# Altium project TLM_002_001.PrjPcb (part 2 of 2)

## Sheet TLM_002_CONNECT.SchDoc: =DocumentName
size A4; Author: Nazar Lysenko/Andrii Antonenko; CompanyName: Scopa Industries LLC; Engineer: Nazar Lysenko / Andrii Antonenko; Organization: Scopa Industries LLC; Address1: Kyiv; Address2: Ukraine; Address3: https://www.scopa.industries/; Address4: oleksyi.y@scopa.industries; Revision: 1; SheetNumber: 11; SheetTotal: 11
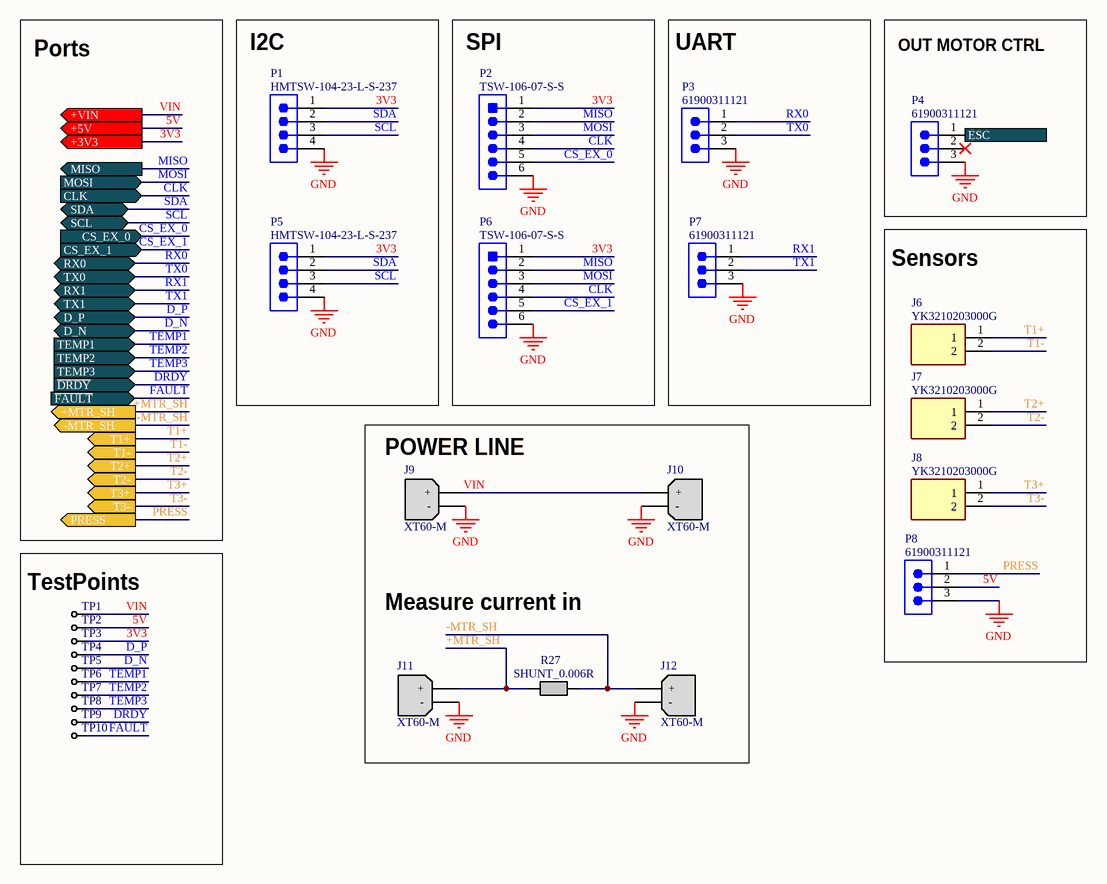
[diagram p10: TLM_002_CONNECT.SchDoc]

### Parts
J6  YK3210203000G  [YK3210203000G]
J7  YK3210203000G  [YK3210203000G]
J8  YK3210203000G  [YK3210203000G]
J9  XT60-M  [AMASS_XT60-M]
J10  XT60-M  [AMASS_XT60-M]
J11  XT60-M  [AMASS_XT60-M]
J12  XT60-M  [AMASS_XT60-M]
P1  HMTSW-104-23-L-S-237  [SMTC-HMTSW-104-23-X-S-237]
P2  TSW-106-07-S-S  [SMTC-TSW-106-07-S-S_V]
P3  61900311121  [61900311121]
P4  61900311121  [61900311121]
P5  HMTSW-104-23-L-S-237  [SMTC-HMTSW-104-23-X-S-237]
P6  TSW-106-07-S-S  [SMTC-TSW-106-07-S-S_V]
P7  61900311121  [61900311121]
P8  61900311121  [61900311121]
R27  SHUNT_0.006R  [SHUNT]
TP1  TestPoint  [TestPoint]  (value not drawn)
TP2  TestPoint  [TestPoint]  (value not drawn)
TP3  TestPoint  [TestPoint]  (value not drawn)
TP4  TestPoint  [TestPoint]  (value not drawn)
TP5  TestPoint  [TestPoint]  (value not drawn)
TP6  TestPoint  [TestPoint]  (value not drawn)
TP7  TestPoint  [TestPoint]  (value not drawn)
TP8  TestPoint  [TestPoint]  (value not drawn)
TP9  TestPoint  [TestPoint]  (value not drawn)
TP10  TestPoint  [TestPoint]  (value not drawn)

### Ports
+3V3 (out, see TLM_002_MBR[4A], TLM_002_SRC[4C]), +5V (out, see TLM_002_MBR[4A], TLM_002_SRC[4A]), +MTR_SH (out, see TLM_002_MBR[4C]), +VIN (out, see TLM_002_MBR[4A]), -MTR_SH (out, see TLM_002_MBR[4C]), CLK (in, see TLM_002_MBR[4B], TLM_002_ESP32S3[2B], TLM_002_MAX6675[2B], TLM_002_MAX31856[2B], TLM_002_SD[3B]), CS_EX_0 (in, see TLM_002_MBR[4B], TLM_002_ESP32S3[3B]), CS_EX_1 (in, see TLM_002_MBR[4B], TLM_002_ESP32S3[3B]), D_N (bidir, see TLM_002_MBR[4C], TLM_002_ESP32S3[3A], TLM_002_SRC[2C]), D_P (bidir, see TLM_002_MBR[4C], TLM_002_ESP32S3[3A], TLM_002_SRC[2C]), ESC (in, see TLM_002_MBR[4C], TLM_002_ESP32S3[3B]), MISO (out, see TLM_002_MBR[4B], TLM_002_ESP32S3[3B], TLM_002_MAX6675[2B], TLM_002_MAX31856[2B], TLM_002_SD[3B]), MOSI (in, see TLM_002_MBR[4B], TLM_002_ESP32S3[2B], TLM_002_MAX31856[2B], TLM_002_SD[3B]), PRESS (out, see TLM_002_MBR[4B], TLM_002_MCP3021[1B]), RX0 (bidir, see TLM_002_MBR[4C], TLM_002_ESP32S3[4A]), RX1 (bidir, see TLM_002_MBR[4C], TLM_002_ESP32S3[2B]), SCL (bidir, see TLM_002_MBR[4C], TLM_002_DS3231SN_RTC[2B], TLM_002_ESP32S3[2B], TLM_002_INA228[2B], TLM_002_MCP3021[4B]), SDA (bidir, see TLM_002_MBR[4B], TLM_002_DS3231SN_RTC[2B], TLM_002_ESP32S3[2B], TLM_002_INA228[2B], TLM_002_MCP3021[3B]), T1+ (out, see TLM_002_MBR[4B]), T1- (out, see TLM_002_MBR[4B]), T2+ (out, see TLM_002_MBR[4B]), T2- (out, see TLM_002_MBR[4B]), T3+ (out, see TLM_002_MBR[4B]), T3- (out, see TLM_002_MBR[4B]), TEMP1 (in, see TLM_002_MBR[4C], TLM_002_ESP32S3[2B]), TEMP2 (in, see TLM_002_MBR[4D], TLM_002_ESP32S3[2B]), TEMP3 (in, see TLM_002_MBR[4D], TLM_002_ESP32S3[2B]), TX0 (bidir, see TLM_002_MBR[4C], TLM_002_ESP32S3[4B]), TX1 (bidir, see TLM_002_MBR[4C], TLM_002_ESP32S3[2B]), ~{DRDY} (in, see TLM_002_MBR[4C], TLM_002_MAX31856[2C]), ~{FAULT} (in, see TLM_002_MBR[4C], TLM_002_MAX31856[2B])

### Nets
3V3: P1.1 P2.1 P5.1 P6.1 TP3.1 ; port +3V3  [project net -3V3_CTRL]
5V: P8.2 TP2.1 ; port +5V  [project net +5V]
GND: J9.2(-) J10.2(-) J11.2(-) J12.2(-) P1.4 P2.6 P3.3 P4.3 P5.4 P6.6 P7.3 P8.3
VIN: J9.1(+) J10.1(+) TP1.1 ; port +VIN
+MTR_SH: J11.1(+) R27.1 ; port +MTR_SH
-MTR_SH: J12.1(+) R27.2 ; port -MTR_SH
CLK: P2.4 P6.4 ; port CLK
CS_EX_0: P2.5 ; port CS_EX_0
CS_EX_1: P6.5 ; port CS_EX_1
~{DRDY}: TP9.1 ; port ~{DRDY}
D_N: TP5.1 ; port D_N
D_P: TP4.1 ; port D_P
ESC: P4.1 ; port ESC
~{FAULT}: TP10.1 ; port ~{FAULT}
MISO: P2.2 P6.2 ; port MISO
MOSI: P2.3 P6.3 ; port MOSI
PRESS: P8.1 ; port PRESS
RX0: P3.1 ; port RX0
RX1: P7.1 ; port RX1
SCL: P1.3 P5.3 ; port SCL
SDA: P1.2 P5.2 ; port SDA
T1+: J6.1 ; port T1+
T1-: J6.2 ; port T1-
T2+: J7.1 ; port T2+
T2-: J7.2 ; port T2-
T3+: J8.1 ; port T3+
T3-: J8.2 ; port T3-
TEMP1: TP6.1 ; port TEMP1
TEMP2: TP7.1 ; port TEMP2
TEMP3: TP8.1 ; port TEMP3
TX0: P3.2 ; port TX0
TX1: P7.2 ; port TX1

Not connected (* = marked no-connect by the designer): P4 2*

### Notes on the sheet
- I2C
- SPI
- UART
- Ports
- OUT MOTOR CTRL (ESC)
- Sensors
- POWER LINE
- TestPoints
- Measure current in motor
- Title
- Size:
- Date:
- A4
- Author:
- Time:
- Sheet
- Revision:
- of
- File:

### Library data of the parts
J6-J8 = YK3210203000G: Connector; Manufacturer_Name: Amphenol; Datasheet Link: https://eu.mouser.com/datasheet/2/18/7Pva_Bm2hlSl-1379478.pdf; Height: 15.9mm; Manufacturer_Part_Number: YK3210203000G; Mouser Part Number: 649-YK32102030J0G; Mouser Price/Stock: https://www.mouser.co.uk/ProductDetail/Amphenol-Anytek/YK3210203000G?qs=Mv7BduZupUi0q03DSkdXZw%3D%3D
J9-J12 = XT60-M: Plug; DC supply; XT60; male; PIN: 2; for cable; soldered; 30A; 500V; MF: AMASS; SnapEDA_Link: https://www.snapeda.com/parts/XT60-M/AMASS/view-part/?ref=snap; Package: Package; MP: XT60-M; Check_prices: https://www.snapeda.com/parts/XT60-M/AMASS/view-part/?ref=eda
P1 P5 = CMP-1024-00020-1: Modified .025" SQ Post Header, Through-hole, Vertical, -55 to 125 degC, 2.54 mm Pitch, 4-Pin, Male, RoHS; Manufacturer: Samtec; Pitch: 2.54 mm; ComponentLink3URL: http://www.samtec.com/documents/webfiles/cpdf/HMTSW-XXX-XX-X-X-XXXX-XX-XX-MKT1.pdf; PartNumber: HMTSW-104-23-L-S-237; Temperature Range: -55 to 125 degC; ComponentLink1Description: Manufacturer URL; Orientation: Vertical; ComponentLink3Description: Package Specification; ComponentLink2URL: http://www.samtec.com/documents/webfiles/pdf/HMTSW.PDF; DatasheetVersion: F-214; PackageDescription: Assembly .025 [.64] SQ. Post Hi-Temp Terminal Strip; ComponentLink1URL: http://www.samtec.com; PackageReference: HMTSW-104-23-X-S-237; RoHS: True; Mounting Technology: Through-hole; ComponentLink2Description: Datasheet; PackageVersion: AL, 3/1987
P2 P6 = CMP-1681-00007-2: Male Header, Pitch 2.54 mm, 1 x 6 Position, Height 8.38 mm, Tail Length 2.54 mm, -55 to 125 degC, RoHS, Bulk; Manufacturer: Samtec; Rows: 1; Contact Finish: Gold; Lead Pitch: 0.1 inch; Package Quantity: 1; Mounting Technology: Through Hole; ComponentLink1Description: Manufacturer URL; Contact Plating: Gold; DatasheetVersion: 12/2015; ComponentLink3Description: Package Specification; PackageDescription: Male Header, Pitch 2.54 mm, 1 x 6 Position, Height 8.38 mm, Tail Length 2.54 mm; Height: 8.38 mm; ComponentLink2Description: Datasheet; RoHSCompliant: true; Colour: Black; Packaging: Bulk; Min Operating Temperature: -55 degC; ComponentLink2URL: http://suddendocs.samtec.com/catalog_english/tsw_th.pdf; Mount: Through Hole; PackageReference: TSW-102-07-S-S; Pins: 6; Max Operating Temperature: 125 degC; ComponentLink3URL: http://suddendocs.samtec.com/prints/tsw-xxx-xx-x-x-xx-xxx-footprint.pdf; Length: 15.24 mm; Contact Material: Bronze; ComponentLink1URL: http://www.samtec.com/
P3 P4 P7 P8 = CMP-1502-00585-2: NexarPartId: 18818222; Current Rating: 3A; Voltage Rating: 250V; Number of Positions: 3; Insulation Resistance: 1GΩ; Gender: Male; Pitch: 2.54mm; Connector Type: Male Pin; Contact Resistance: 20mΩ; Termination: Through Hole; Width: 7.66mm; Contact Plating: Tin; Orientation: Vertical; Mount: Through Hole; Contact Gender: Male; Max Operating Temperature: 105°C; Length: 7.62mm; Number of Rows: 1; Height: 12.5mm; Lead Pitch: 2.54mm; Housing Material: Nylon; Color: Beige; Contact Material: Copper; Fastening Type: Friction; Min Operating Temperature: -40°C; Number of Contacts: 3; Number of Pins: 3; Flammability Rating: UL94 V-0; Contact Mating Length: 7.493mm; RoHS: Compliant; REACH SVHC: Unknown; Packaging: Bulk; Operating Supply Voltage: 250V

## Nets that join several sheets
+5V: TLM_002_MCP3021 (5 pins), INA228_1 (R12_INA228_1.2), TLM_002_SRC (C29.2 IC5.3 R18.1), TLM_002_CONNECT (P8.2 TP2.1)
-3V3_CTRL: MAX6675_1 (C5_MAX6675_1.2 C6_MAX6675_1.2 IC2_MAX6675_1.4), TLM_002_MCP3021 (Q1.2 Q1.5), INA228_3 (C14_INA228_3.2 C15_INA228_3.2 U1_INA228_3.2 U1_INA228_3.6), TLM_002_ESP32S3 (7 pins), TLM_002_MAX31856 (6 pins), TLM_002_SD (7 pins), TLM_002_DS3231SN_RTC (C18.2 C19.2 U2.2), MAX6675_2 (C5_MAX6675_2.2 C6_MAX6675_2.2 IC2_MAX6675_2.4), INA228_2 (5 pins), INA228_1 (C14_INA228_1.2 C15_INA228_1.2 U1_INA228_1.6), TLM_002_SRC (R21.1), TLM_002_LoRa (C30.2 C31.2 IC6.3), TLM_002_CONNECT (5 pins)
GND: MAX6675_1 (C5_MAX6675_1.1 C6_MAX6675_1.1 IC2_MAX6675_1.1), TLM_002_MCP3021 (C20.1 C21.1 C22.1 U3.2), INA228_3 (C14_INA228_3.1 C15_INA228_3.1 U1_INA228_3.1 U1_INA228_3.7), TLM_002_ESP32S3 (19 pins), TLM_002_MAX31856 (8 pins), TLM_002_SD (7 pins), TLM_002_DS3231SN_RTC (BT1.1 C18.1 C19.1 U2.13), MAX6675_2 (C5_MAX6675_2.1 C6_MAX6675_2.1 IC2_MAX6675_2.1), INA228_2 (C14_INA228_2.1 C15_INA228_2.1 U1_INA228_2.2 U1_INA228_2.7), INA228_1 (5 pins), TLM_002_SRC (19 pins), TLM_002_LoRa (6 pins), TLM_002_CONNECT (12 pins)
+3V3_CTRL: INA228_2 (R11_INA228_2.2 U1_INA228_2.8), TLM_002_SRC (5 pins)
+5V_CTRL: INA228_1 (R11_INA228_1.2 U1_INA228_1.8), TLM_002_SRC (DS1.2 Q2.2 R18.2)
+MTR_SH: INA228_3 (R11_INA228_3.2 U1_INA228_3.8), TLM_002_CONNECT (J11.1 R27.1)
-MTR_SH: INA228_3 (R12_INA228_3.2), TLM_002_CONNECT (J12.1 R27.2)
CLK: MAX6675_1 (IC2_MAX6675_1.5), TLM_002_ESP32S3 (IC1.19), TLM_002_MAX31856 (IC3.10), TLM_002_SD (R14.13), MAX6675_2 (IC2_MAX6675_2.5), TLM_002_CONNECT (P2.4 P6.4)
CS_EX_0: TLM_002_ESP32S3 (IC1.31), TLM_002_CONNECT (P2.5)
CS_EX_1: TLM_002_ESP32S3 (IC1.25), TLM_002_CONNECT (P6.5)
CS_SD: TLM_002_ESP32S3 (IC1.5), TLM_002_SD (R14.15)
~{DRDY}: TLM_002_ESP32S3 (IC1.9), TLM_002_MAX31856 (IC3.7), TLM_002_CONNECT (TP9.1)
D_N: TLM_002_ESP32S3 (IC1.13), TLM_002_SRC (D2.4), TLM_002_CONNECT (TP5.1)
D_P: TLM_002_ESP32S3 (IC1.14), TLM_002_SRC (D2.6), TLM_002_CONNECT (TP4.1)
ESC: TLM_002_ESP32S3 (IC1.24), TLM_002_CONNECT (P4.1)
~{FAULT}: TLM_002_ESP32S3 (IC1.8), TLM_002_MAX31856 (IC3.13), TLM_002_CONNECT (TP10.1)
LoRa_CLK: TLM_002_ESP32S3 (IC1.23), TLM_002_LoRa (IC6.12)
LoRa_CS: TLM_002_ESP32S3 (IC1.4), TLM_002_LoRa (IC6.15)
LoRa_DIO0: TLM_002_ESP32S3 (IC1.32), TLM_002_LoRa (IC6.5)
LoRa_DIO1: TLM_002_ESP32S3 (IC1.33), TLM_002_LoRa (IC6.6)
LoRa_DIO2: TLM_002_ESP32S3 (IC1.34), TLM_002_LoRa (IC6.7)
LoRa_MISO: TLM_002_ESP32S3 (IC1.10), TLM_002_LoRa (IC6.13)
LoRa_MOSI: TLM_002_ESP32S3 (IC1.11), TLM_002_LoRa (IC6.14)
LoRa_RST: TLM_002_ESP32S3 (IC1.35), TLM_002_LoRa (IC6.4)
MISO: MAX6675_1 (IC2_MAX6675_1.7), TLM_002_ESP32S3 (IC1.21), TLM_002_MAX31856 (IC3.11), TLM_002_SD (R14.16), MAX6675_2 (IC2_MAX6675_2.7), TLM_002_CONNECT (P2.2 P6.2)
MOSI: TLM_002_ESP32S3 (IC1.20), TLM_002_MAX31856 (IC3.12), TLM_002_SD (R14.14), TLM_002_CONNECT (P2.3 P6.3)
PRESS: TLM_002_MCP3021 (R15.1), TLM_002_CONNECT (P8.1)
~{RST}_RTC: TLM_002_ESP32S3 (IC1.22), TLM_002_DS3231SN_RTC (U2.4)
RX0: TLM_002_ESP32S3 (R2.2), TLM_002_CONNECT (P3.1)
RX1: TLM_002_ESP32S3 (R5.1), TLM_002_CONNECT (P7.1)
SCL: TLM_002_MCP3021 (Q1.1), INA228_3 (U1_INA228_3.5), TLM_002_ESP32S3 (IC1.17 R9.2), TLM_002_DS3231SN_RTC (U2.15), INA228_2 (U1_INA228_2.5), INA228_1 (U1_INA228_1.5), TLM_002_CONNECT (P1.3 P5.3)
SDA: TLM_002_MCP3021 (Q1.4), INA228_3 (U1_INA228_3.4), TLM_002_ESP32S3 (IC1.12 R10.2), TLM_002_DS3231SN_RTC (U2.16), INA228_2 (U1_INA228_2.4), INA228_1 (U1_INA228_1.4), TLM_002_CONNECT (P1.2 P5.2)
T1+: MAX6675_1 (IC2_MAX6675_1.3), TLM_002_CONNECT (J6.1)
T1-: MAX6675_1 (IC2_MAX6675_1.2), TLM_002_CONNECT (J6.2)
T2+: MAX6675_2 (IC2_MAX6675_2.3), TLM_002_CONNECT (J7.1)
T2-: MAX6675_2 (IC2_MAX6675_2.2), TLM_002_CONNECT (J7.2)
T3+: TLM_002_MAX31856 (C9.1 C12.2 IC3.4), TLM_002_CONNECT (J8.1)
T3-: TLM_002_MAX31856 (C12.1 C13.2 IC3.2 IC3.3), TLM_002_CONNECT (J8.2)
TEMP1: MAX6675_1 (IC2_MAX6675_1.6), TLM_002_ESP32S3 (IC1.18), TLM_002_CONNECT (TP6.1)
TEMP2: TLM_002_ESP32S3 (IC1.7), MAX6675_2 (IC2_MAX6675_2.6), TLM_002_CONNECT (TP7.1)
TEMP3: TLM_002_ESP32S3 (IC1.6), TLM_002_MAX31856 (IC3.9), TLM_002_CONNECT (TP8.1)
TX0: TLM_002_ESP32S3 (R3.2), TLM_002_CONNECT (P3.2)
TX1: TLM_002_ESP32S3 (R6.1), TLM_002_CONNECT (P7.2)